# Altium schematic sheet 1-sch.SchDoc: Thermocouple Temperature Logger - front test PCB
size A4; Date: 10.05.2026; Author: MG; Revision: 1-0; SheetNumber: 1; SheetTotal: 1; Model: Rev 1.0; PageSetup: Record=PageOptions|CenterHorizontal=True|CenterVertical=True|PrintScale=0.52|XCorrection=1.00|YCorrection=1.00|PrintKind=1|BorderSize=5000000|LeftOffset=0|BottomOffset=0|Orientation=2|PaperLength=4200|PaperWidth=2970|Scale=100|PaperSource=7|PrintQuality=600|MediaType=1|DitherType=10|PaperKind=A3|PrintScaleMode=1
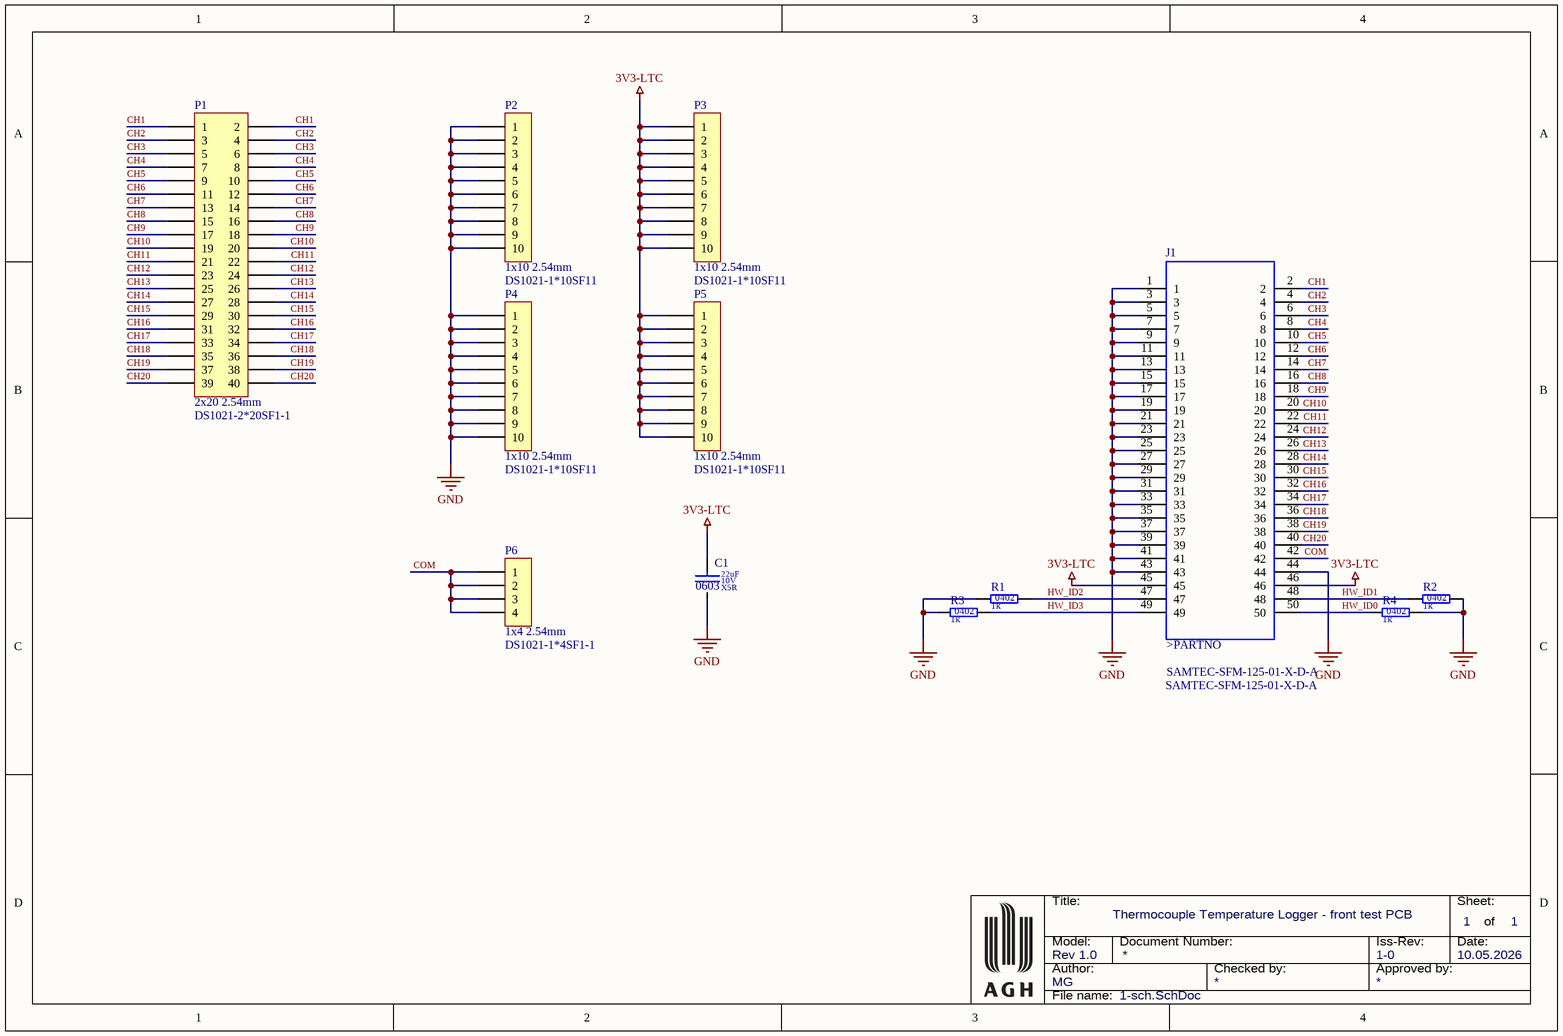
[diagram p0: 1-sch.SchDoc]

## Parts
C1  value 22uF  Dielectric: X5R  Voltage: 10V  SCH_Footprint: 0603  [C_0603_1608]  (hidden comment: Ceramic X5R)
J1  SAMTEC-SFM-125-01-X-D-A  [SAMTEC-SFM-125-01-X-D-A]
P1  value DS1021-2*20SF1-1  SCH_Footprint: 2x20 2.54mm  [P_HEADER_2x20_2.54]  (hidden comment: Goldpin male)
P2  value DS1021-1*10SF11  SCH_Footprint: 1x10 2.54mm  [P_HEADER_1x10_2.54]  (hidden comment: Goldpin)
P3  value DS1021-1*10SF11  SCH_Footprint: 1x10 2.54mm  [P_HEADER_1x10_2.54]  (hidden comment: Goldpin)
P4  value DS1021-1*10SF11  SCH_Footprint: 1x10 2.54mm  [P_HEADER_1x10_2.54]  (hidden comment: Goldpin)
P5  value DS1021-1*10SF11  SCH_Footprint: 1x10 2.54mm  [P_HEADER_1x10_2.54]  (hidden comment: Goldpin)
P6  value DS1021-1*4SF1-1  SCH_Footprint: 1x4 2.54mm  [P_HEADER_1x4_2.54]  (hidden comment: Goldpin)
R1  value 1k  SCH_Footprint: 0402  [R_0402_1005]  (hidden comment: Resistor)
R2  value 1k  SCH_Footprint: 0402  [R_0402_1005]  (hidden comment: Resistor)
R3  value 1k  SCH_Footprint: 0402  [R_0402_1005]  (hidden comment: Resistor)
R4  value 1k  SCH_Footprint: 0402  [R_0402_1005]  (hidden comment: Resistor)

## Nets
3V3-LTC: C1.1 J1.45 J1.46 P3.1 P3.2 P3.3 P3.4 P3.5 P3.6 P3.7 P3.8 P3.9 P3.10 P5.1 P5.2 P5.3 P5.4 P5.5 P5.6 P5.7 P5.8 P5.9 P5.10
GND: C1.2 J1.1 J1.3 J1.5 J1.7 J1.9 J1.11 J1.13 J1.15 J1.17 J1.19 J1.21 J1.23 J1.25 J1.27 J1.29 J1.31 J1.33 J1.35 J1.37 J1.39 J1.41 J1.43 J1.44 P2.1 P2.2 P2.3 P2.4 P2.5 P2.6 P2.7 P2.8 P2.9 P2.10 P4.1 P4.2 P4.3 P4.4 P4.5 P4.6 P4.7 P4.8 P4.9 P4.10 R1.1 R2.2 R3.1 R4.2
CH1: J1.2 P1.1 P1.2
CH2: J1.4 P1.3 P1.4
CH3: J1.6 P1.5 P1.6
CH4: J1.8 P1.7 P1.8
CH5: J1.10 P1.9 P1.10
CH6: J1.12 P1.11 P1.12
CH7: J1.14 P1.13 P1.14
CH8: J1.16 P1.15 P1.16
CH9: J1.18 P1.17 P1.18
CH10: J1.20 P1.19 P1.20
CH11: J1.22 P1.21 P1.22
CH12: J1.24 P1.23 P1.24
CH13: J1.26 P1.25 P1.26
CH14: J1.28 P1.27 P1.28
CH15: J1.30 P1.29 P1.30
CH16: J1.32 P1.31 P1.32
CH17: J1.34 P1.33 P1.34
CH18: J1.36 P1.35 P1.36
CH19: J1.38 P1.37 P1.38
CH20: J1.40 P1.39 P1.40
COM: J1.42 P6.1 P6.2 P6.3 P6.4
HW_ID0: J1.50 R4.1
HW_ID1: J1.48 R2.1
HW_ID2: J1.47 R1.2
HW_ID3: J1.49 R3.2

## Notes on the sheet
- Title:
- Sheet:
- of
- Author:
- Model:
- Document Number:
- Checked by:
- Iss-Rev:
- Approved by:
- Date:
- File name:
- (in symbol SAMTEC-SFM-125-01-X-D-A) >PARTNO

## Library data of the parts
C1 = C_22uF_10V_X5R_0603_20: Capacitor; Manufacturer: Murata; Manufacturer Part Number: GRM188R61A226ME15D; Tolerance (%): 20; Part Number: C_22uF_10V_X5R_0603_20; HelpURL: https://www.mouser.pl/datasheet/2/281/1/GRM188R61A226ME15_02A-1985787.pdf; Supplier 1: TME; Supplier Part Number 1: GRM188R61A226ME15D; Supplier 2: RS Components; Supplier 3: Farnell; Supplier Part Number 3: 2426957; Supplier 4: Mouser; Supplier Part Number 4: 81-GRM188R61A226ME5D; Supplier 5: Digi-Key; Supplier Part Number 5: 490-10476-1-ND; Supplier 6: LCSC
P1 = P_HEADER_2x20_2.54: Pin Header; Manufacturer: Connfly; Part Number: P_HEADER_2x20_2.54; HelpURL: https://www.tme.eu/Document/cc301e58a5da78cb543a94b5a5b7f06a/DS1021.pdf; Manufacturer Part Number: DS1021-2*20SF1-1; Supplier 1: TME; Supplier Part Number 1: ZL202-40G; Supplier 2: RS Components; Supplier 3: Farnell; Supplier 4: Mouser; Supplier 5: Digi-Key; Supplier 6: LCSC
P2-P5 = P_HEADER_1x10_2.54: Pin Header; Manufacturer: Connfly; Part Number: P_HEADER_1x10_2.54; HelpURL: http://www.tme.eu/en/Document/cc301e58a5da78cb543a94b5a5b7f06a/DS1021.pdf; Manufacturer Part Number: DS1021-1*10SF11; Supplier 1: TME; Supplier Part Number 1: ZL201-10G; Supplier 2: RS Components; Supplier 3: Farnell; Supplier 4: Mouser; Supplier 5: Digi-Key; Supplier 6: LCSC
P6 = P_HEADER_1x4_2.54: Pin Header; Manufacturer: Connfly; Part Number: P_HEADER_1x4_2.54; HelpURL: http://datasheet.octopart.com/DS1021-1%2A4SF1-1-Connfly-datasheet-65537859.pdf; Manufacturer Part Number: DS1021-1*4SF1-1; Supplier 1: TME; Supplier Part Number 1: ZL201-04G; Supplier 2: RS Components; Supplier 3: Farnell; Supplier 4: Mouser; Supplier 5: Digi-Key; Supplier 6: LCSC
R1-R4 = R_1k_0402_1: Manufacturer: Yageo; Manufacturer Part Number: RC0402FR-071K; Voltage: 50V; Power: 63mW; Tolerance: 1%; Part Number: R_1k_0402_1; HelpURL: http://www.tme.eu/pl/Document/1a2bc76e2be68b3b1670068306778ce6/rc0402yageo.pdf; Supplier 1: TME; Supplier Part Number 1: RC0402FR-071K; Supplier 2: RS Components; Supplier 3: Farnell; Supplier Part Number 3: 9239235; Supplier 4: Mouser; Supplier Part Number 4: 603-RC0402FR-071KP; Supplier 5: Digi-Key; Supplier Part Number 5: 311-1.00KLRCT-ND; Supplier 6: LCSC
J1 = SAMTEC-SFM-125-01-X-D-A: Package: None; MP: SAMTEC-SFM-125-01-X-D-A; Value: *; Price: None; Availability: Unavailable